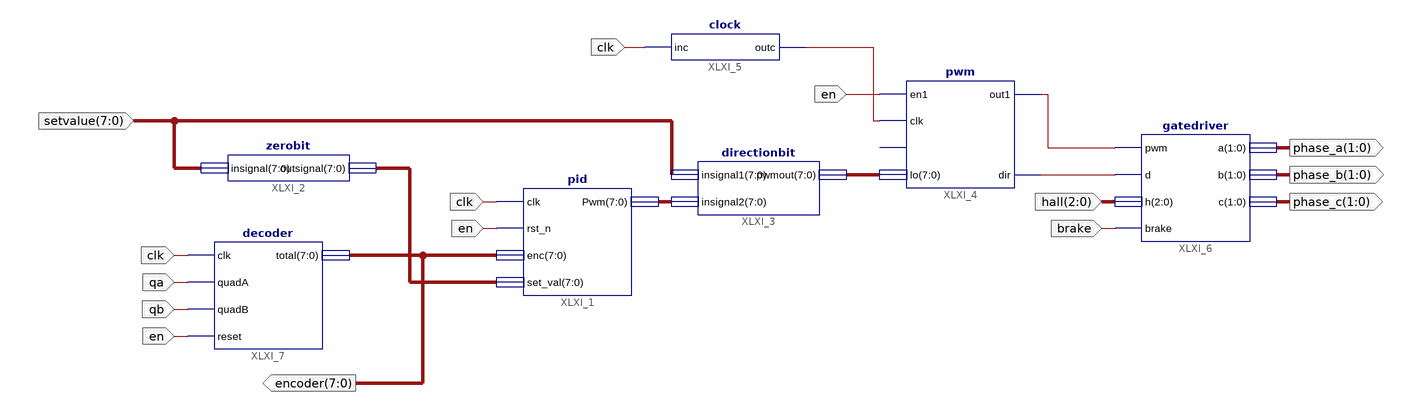
[diagram p0: schematic sheet 1]
// Xilinx ISE schematic motormodule.sch (spartan6) as structural Verilog: 7 symbols, 11 ports
module motormodule (
  input  [7:0] setvalue,
  input  clk,
  input  qa,
  input  qb,
  input  en,
  input  [2:0] hall,
  input  brake,
  output [7:0] encoder,
  output [1:0] phase_a,
  output [1:0] phase_b,
  output [1:0] phase_c
);

  wire XLXN_6, XLXN_7, XLXN_20;
  wire [7:0] XLXN_3, XLXN_15, XLXN_99;

  pid XLXI_1 (.clk(clk), .rst_n(en), .enc(encoder), .set_val(XLXN_99), .Pwm(XLXN_3));
  zerobit XLXI_2 (.insignal(setvalue), .outsignal(XLXN_99));
  pwm XLXI_4 (.en1(en), .clk(XLXN_6), .lo(XLXN_15), .out1(XLXN_7), .dir(XLXN_20));  // open: cl
  clock XLXI_5 (.inc(clk), .outc(XLXN_6));
  decoder XLXI_7 (.clk(clk), .quadA(qa), .quadB(qb), .reset(en), .total(encoder));
  directionbit XLXI_3 (.insignal1(setvalue), .insignal2(XLXN_3), .pwmout(XLXN_15));
  gatedriver XLXI_6 (.pwm(XLXN_7), .d(XLXN_20), .brake(brake), .h(hall), .a(phase_a), .b(phase_b), .c(phase_c));
endmodule
